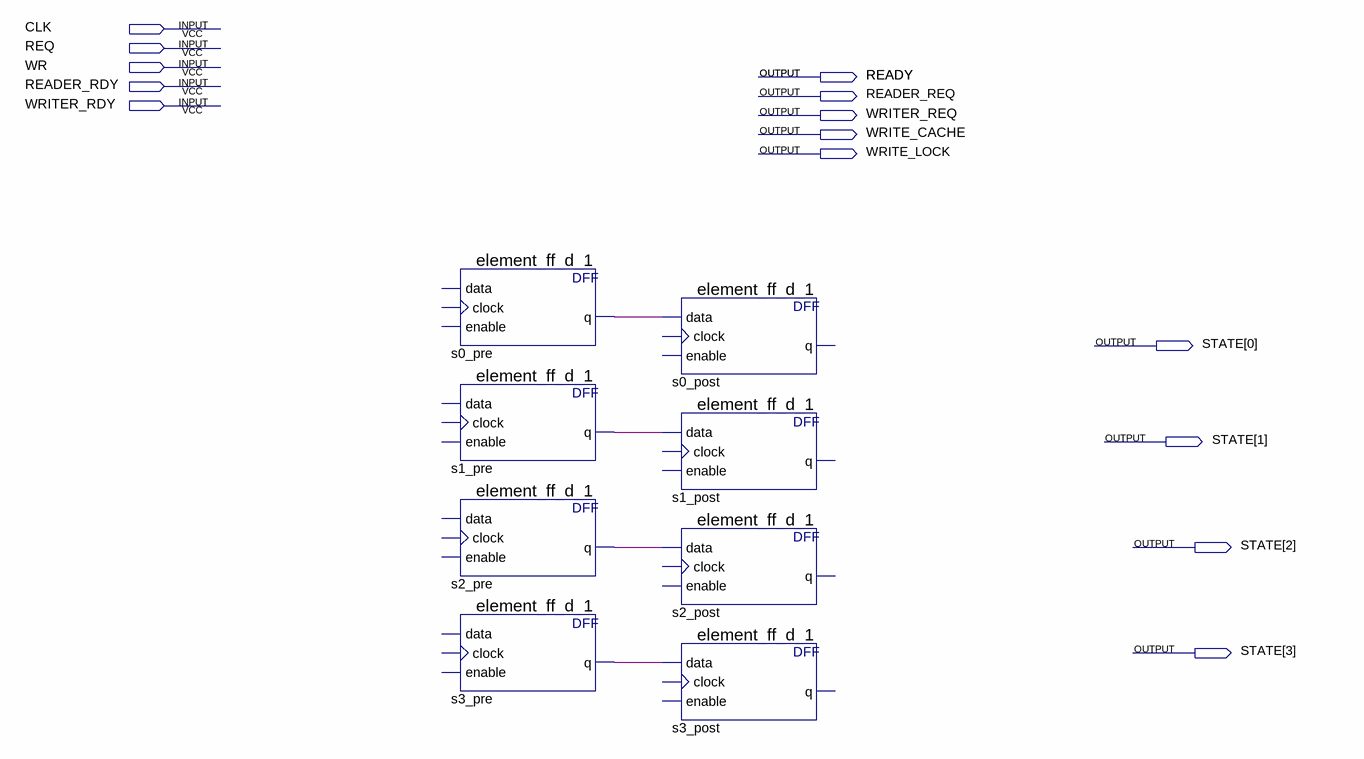
[diagram p0: schematic sheet]
// Quartus schematic block-data-cache-state-machine.bdf as structural Verilog: 8 symbols, 15 pins
module \block-data-cache-state-machine  (
  input  CLK,
  input  REQ,
  input  WR,
  input  READER_RDY,
  input  WRITER_RDY,
  output READY,
  output READER_REQ,
  output WRITER_REQ,
  output WRITE_CACHE,
  output WRITE_LOCK,
  output [3:0] STATE
);

  wire s0_pre_q, s1_pre_q, s2_pre_q, s3_pre_q;

  element_ff_d_1 s0_pre (.q(s0_pre_q));  // open: data, clock, enable
  element_ff_d_1 s1_pre (.q(s1_pre_q));  // open: data, clock, enable
  element_ff_d_1 s2_pre (.q(s2_pre_q));  // open: data, clock, enable
  element_ff_d_1 s3_pre (.q(s3_pre_q));  // open: data, clock, enable
  element_ff_d_1 s0_post (.data(s0_pre_q));  // open: clock, enable, q
  element_ff_d_1 s1_post (.data(s1_pre_q));  // open: clock, enable, q
  element_ff_d_1 s2_post (.data(s2_pre_q));  // open: clock, enable, q
  element_ff_d_1 s3_post (.data(s3_pre_q));  // open: clock, enable, q
endmodule
